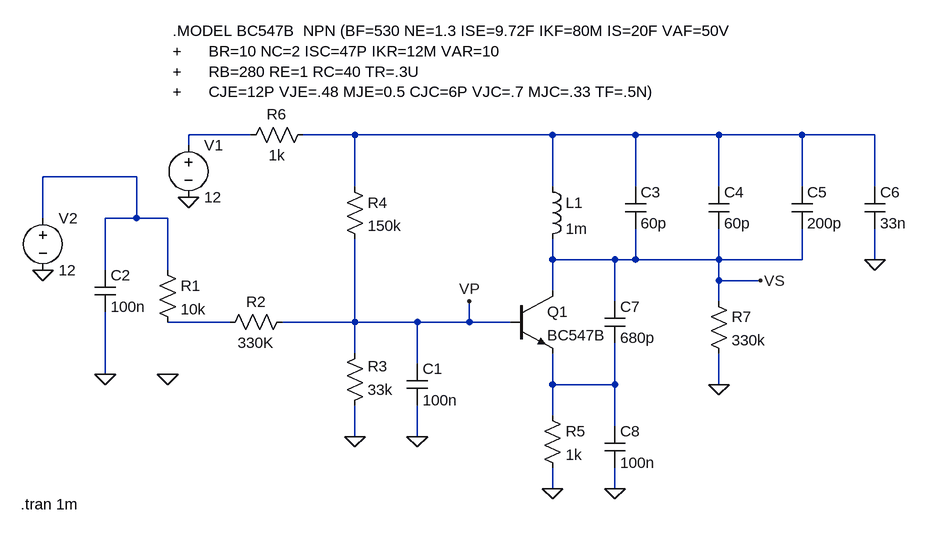
[diagram p0: schematic OSCILADOR DE PITCH.asc]
OSCILADOR DE PITCH.asc, the LTspice schematic file:
Version 4
SHEET 1 1224 680
WIRE 176 -80 80 -80
WIRE 336 -80 256 -80
WIRE 640 -80 336 -80
WIRE 768 -80 640 -80
WIRE 896 -80 768 -80
WIRE 1024 -80 896 -80
WIRE 1136 -80 1024 -80
WIRE 80 -64 80 -80
WIRE 0 -16 -144 -16
WIRE 336 0 336 -80
WIRE 640 0 640 -80
WIRE 768 0 768 -80
WIRE 896 0 896 -80
WIRE 1024 0 1024 -80
WIRE 1136 0 1136 -80
WIRE -144 48 -144 -16
WIRE 0 48 0 -16
WIRE 0 48 -48 48
WIRE 48 48 0 48
WIRE 640 112 640 80
WIRE 736 112 640 112
WIRE 768 112 768 64
WIRE 768 112 736 112
WIRE 896 112 896 64
WIRE 896 112 768 112
WIRE 1024 112 1024 64
WIRE 1024 112 896 112
WIRE 1136 112 1136 64
WIRE -48 128 -48 48
WIRE 48 128 48 48
WIRE 896 144 896 112
WIRE 960 144 896 144
WIRE 640 160 640 112
WIRE 736 176 736 112
WIRE 896 176 896 144
WIRE 144 208 48 208
WIRE 336 208 336 80
WIRE 336 208 224 208
WIRE 432 208 336 208
WIRE 512 208 512 176
WIRE 512 208 432 208
WIRE 576 208 512 208
WIRE 336 256 336 208
WIRE 432 272 432 208
WIRE -48 288 -48 192
WIRE 640 304 640 256
WIRE 736 304 736 240
WIRE 736 304 640 304
WIRE 896 304 896 256
WIRE 640 352 640 304
WIRE 736 368 736 304
WIRE 336 384 336 336
WIRE 432 384 432 336
WIRE 640 464 640 432
WIRE 736 464 736 432
FLAG 336 384 0
FLAG 432 384 0
FLAG -48 288 0
FLAG 1136 112 0
FLAG 640 464 0
FLAG 736 464 0
FLAG -144 128 0
FLAG 80 16 0
FLAG 896 304 0
FLAG 48 288 0
FLAG 960 144 VS
FLAG 512 176 VP
SYMBOL res 32 112 R0
SYMATTR InstName R1
SYMATTR Value 10k
SYMBOL res 320 352 M180
WINDOW 0 36 76 Left 2
WINDOW 3 36 40 Left 2
SYMATTR InstName R3
SYMATTR Value 33k
SYMBOL cap 416 272 R0
SYMATTR InstName C1
SYMATTR Value 100n
SYMBOL cap -64 128 R0
SYMATTR InstName C2
SYMATTR Value 100n
SYMBOL npn 576 160 R0
SYMATTR InstName Q1
SYMATTR Value BC547B
SYMBOL ind 624 -16 R0
SYMATTR InstName L1
SYMATTR Value 1m
SYMBOL cap 752 0 R0
SYMATTR InstName C3
SYMATTR Value 60p
SYMBOL cap 880 0 R0
SYMATTR InstName C4
SYMATTR Value 60p
SYMBOL cap 1008 0 R0
SYMATTR InstName C5
SYMATTR Value 200p
SYMBOL cap 1120 0 R0
SYMATTR InstName C6
SYMATTR Value 33n
SYMBOL cap 720 176 R0
SYMATTR InstName C7
SYMATTR Value 680p
SYMBOL res 624 336 R0
SYMATTR InstName R5
SYMATTR Value 1k
SYMBOL cap 720 368 R0
SYMATTR InstName C8
SYMATTR Value 100n
SYMBOL res 320 -16 R0
SYMATTR InstName R4
SYMATTR Value 150k
SYMBOL voltage 80 -80 R0
SYMATTR InstName V1
SYMATTR Value 12
SYMBOL voltage -144 32 R0
SYMATTR InstName V2
SYMATTR Value 12
SYMBOL res 272 -96 R90
WINDOW 0 0 56 VBottom 2
WINDOW 3 32 56 VTop 2
SYMATTR InstName R6
SYMATTR Value 1k
SYMBOL res 880 160 R0
SYMATTR InstName R7
SYMATTR Value 330k
SYMBOL res 240 192 R90
WINDOW 0 0 56 VBottom 2
WINDOW 3 32 56 VTop 2
SYMATTR InstName R2
SYMATTR Value 330K
TEXT 56 -240 Left 2 !.MODEL BC547B  NPN (BF=530 NE=1.3 ISE=9.72F IKF=80M IS=20F VAF=50V\n+      BR=10 NC=2 ISC=47P IKR=12M VAR=10\n+      RB=280 RE=1 RC=40 TR=.3U\n+      CJE=12P VJE=.48 MJE=0.5 CJC=6P VJC=.7 MJC=.33 TF=.5N)
TEXT -178 488 Left 2 !.tran 1m

The netlist it stands for:
* OSCILADOR DE PITCH.asc
R1 N003 N004 10k
R3 0 VP 33k
C1 VP 0 100n
C2 N003 0 100n
Q1 VS VP N005 0 BC547B
L1 N002 VS 1m
C3 N002 VS 60p
C4 N002 VS 60p
C5 N002 VS 200p
C6 N002 0 33n
C7 VS N005 680p
R5 N005 0 1k
C8 N005 0 100n
R4 N002 VP 150k
V1 N001 0 12
V2 N003 0 12
R6 N002 N001 1k
R7 VS 0 330k
R2 VP N004 330K
.model NPN NPN
.model PNP PNP
.lib standard.bjt
.MODEL BC547B  NPN (BF=530 NE=1.3 ISE=9.72F IKF=80M IS=20F VAF=50V
+      BR=10 NC=2 ISC=47P IKR=12M VAR=10
+      RB=280 RE=1 RC=40 TR=.3U
+      CJE=12P VJE=.48 MJE=0.5 CJC=6P VJC=.7 MJC=.33 TF=.5N)
.tran 1m
.backanno
.end